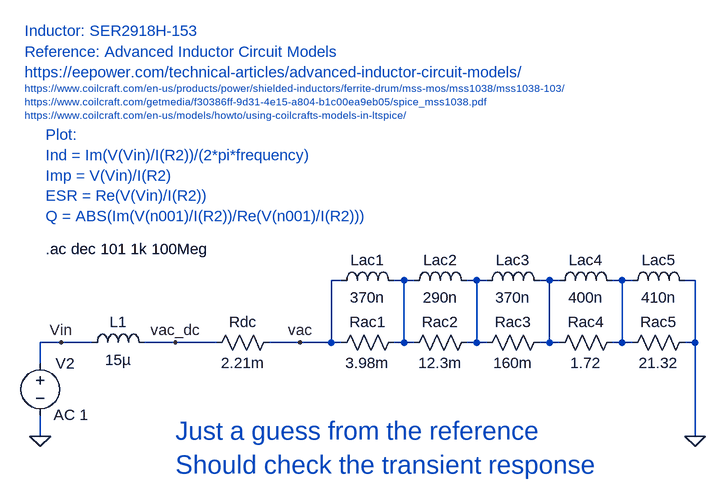
[diagram p0: schematic 10-SER2918H-153_non-linear_model_ridley_Rac.asc]
10-SER2918H-153_non-linear_model_ridley_Rac.asc, the LTspice schematic file:
Version 4
SHEET 1 1668 1520
WIRE 96 112 80 112
WIRE 192 112 176 112
WIRE 208 112 192 112
WIRE 304 112 288 112
WIRE 320 112 304 112
WIRE 416 112 400 112
WIRE 432 112 416 112
WIRE 528 112 512 112
WIRE 544 112 528 112
WIRE 640 112 624 112
WIRE -336 208 -368 208
WIRE -288 208 -336 208
WIRE -160 208 -208 208
WIRE -96 208 -160 208
WIRE 32 208 -16 208
WIRE 80 208 80 112
WIRE 80 208 32 208
WIRE 96 208 80 208
WIRE 192 208 192 112
WIRE 192 208 176 208
WIRE 208 208 192 208
WIRE 304 208 304 112
WIRE 304 208 288 208
WIRE 320 208 304 208
WIRE 416 208 416 112
WIRE 416 208 400 208
WIRE 432 208 416 208
WIRE 528 208 528 112
WIRE 528 208 512 208
WIRE 544 208 528 208
WIRE 640 208 640 112
WIRE 640 208 624 208
WIRE -368 240 -368 208
WIRE -368 352 -368 320
WIRE 640 352 640 208
FLAG -368 352 0
FLAG 640 352 0
FLAG -336 208 Vin
FLAG -160 208 vac_dc
FLAG 32 208 vac
SYMBOL voltage -368 224 R0
WINDOW 123 21 95 Left 2
WINDOW 39 0 0 Left 0
SYMATTR Value2 AC 1
SYMATTR InstName V2
SYMATTR Value ""
SYMBOL res 0 192 R90
WINDOW 0 0 56 VBottom 2
WINDOW 3 32 56 VTop 2
SYMATTR InstName Rdc
SYMATTR Value 2.21m
SYMBOL res 192 192 R90
WINDOW 0 0 56 VBottom 2
WINDOW 3 32 56 VTop 2
SYMATTR InstName Rac1
SYMATTR Value 3.98m
SYMBOL res 304 192 R90
WINDOW 0 0 56 VBottom 2
WINDOW 3 32 56 VTop 2
SYMATTR InstName Rac2
SYMATTR Value 12.3m
SYMBOL res 416 192 R90
WINDOW 0 0 56 VBottom 2
WINDOW 3 32 56 VTop 2
SYMATTR InstName Rac3
SYMATTR Value 160m
SYMBOL res 528 192 R90
WINDOW 0 0 56 VBottom 2
WINDOW 3 32 56 VTop 2
SYMATTR InstName Rac4
SYMATTR Value 1.72
SYMBOL res 640 192 R90
WINDOW 0 0 56 VBottom 2
WINDOW 3 32 56 VTop 2
SYMATTR InstName Rac5
SYMATTR Value 21.32
SYMBOL ind 80 128 R270
WINDOW 0 32 56 VTop 2
WINDOW 3 5 56 VBottom 2
SYMATTR InstName Lac1
SYMATTR Value 370n
SYMBOL ind 192 128 R270
WINDOW 0 32 56 VTop 2
WINDOW 3 5 56 VBottom 2
SYMATTR InstName Lac2
SYMATTR Value 290n
SYMBOL ind 304 128 R270
WINDOW 0 32 56 VTop 2
WINDOW 3 5 56 VBottom 2
SYMATTR InstName Lac3
SYMATTR Value 370n
SYMBOL ind 416 128 R270
WINDOW 0 32 56 VTop 2
WINDOW 3 5 56 VBottom 2
SYMATTR InstName Lac4
SYMATTR Value 400n
SYMBOL ind 528 128 R270
WINDOW 0 32 56 VTop 2
WINDOW 3 5 56 VBottom 2
SYMATTR InstName Lac5
SYMATTR Value 410n
SYMBOL ind -304 224 R270
WINDOW 0 32 56 VTop 2
WINDOW 3 5 56 VBottom 2
SYMATTR InstName L1
SYMATTR Value 15µ
TEXT -360 64 Left 2 !.ac dec 101 1k 100Meg
TEXT -392 -272 Left 2 ;Inductor: SER2918H-153
TEXT -392 -184 Left 1 ;https://www.coilcraft.com/en-us/products/power/shielded-inductors/ferrite-drum/mss-mos/mss1038/mss1038-103/\nhttps://www.coilcraft.com/getmedia/f30386ff-9d31-4e15-a804-b1c00ea9eb05/spice_mss1038.pdf\nhttps://www.coilcraft.com/en-us/models/howto/using-coilcrafts-models-in-ltspice/
TEXT -360 -112 Left 2 ;Plot:\nInd = Im(V(Vin)/I(R2))/(2*pi*frequency)\nImp = V(Vin)/I(R2)\nESR = Re(V(Vin)/I(R2))\nQ = ABS(Im(V(n001)/I(R2))/Re(V(n001)/I(R2)))
TEXT -392 -240 Left 2 ;Reference: Advanced Inductor Circuit Models\nhttps://eepower.com/technical-articles/advanced-inductor-circuit-models/
TEXT -160 344 Left 4 ;Just a guess from the reference\nShould check the transient response

The netlist it stands for:
* 10-SER2918H-153_non-linear_model_ridley_Rac.asc
V2 Vin 0 AC 1
Rdc vac vac_dc 2.21m
Rac1 N001 vac 3.98m
Rac2 N002 N001 12.3m
Rac3 N003 N002 160m
Rac4 N004 N003 1.72
Rac5 0 N004 21.32
Lac1 vac N001 370n
Lac2 N001 N002 290n
Lac3 N002 N003 370n
Lac4 N003 N004 400n
Lac5 N004 0 410n
L1 Vin vac_dc 15µ
.ac dec 101 1k 100Meg
* Inductor: SER2918H-153
* https://www.coilcraft.com/en-us/products/power/shielded-inductors/ferrite-drum/mss-mos/mss1038/mss1038-103/
* https://www.coilcraft.com/getmedia/f30386ff-9d31-4e15-a804-b1c00ea9eb05/spice_mss1038.pdf
* https://www.coilcraft.com/en-us/models/howto/using-coilcrafts-models-in-ltspice/
* Plot:
* Ind = Im(V(Vin)/I(R2))/(2*pi*frequency)
* Imp = V(Vin)/I(R2)
* ESR = Re(V(Vin)/I(R2))
* Q = ABS(Im(V(n001)/I(R2))/Re(V(n001)/I(R2)))
* Reference: Advanced Inductor Circuit Models
* https://eepower.com/technical-articles/advanced-inductor-circuit-models/
* Just a guess from the reference
* Should check the transient response
.backanno
.end

* Results of the author's LTspice run, read from the files saved beside the schematic
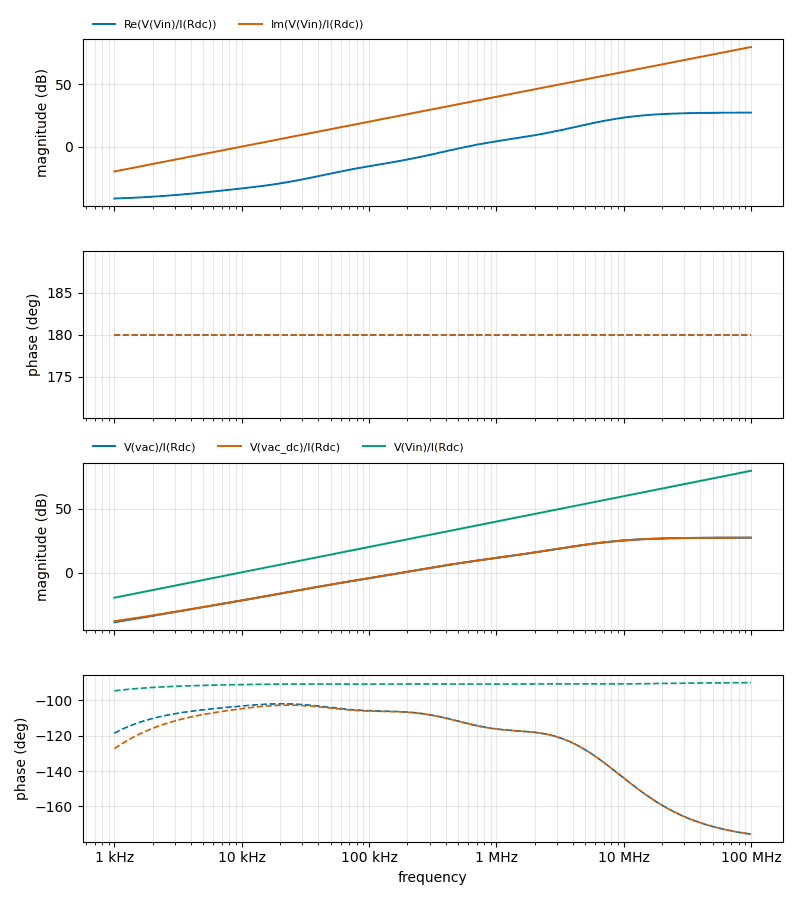
[diagram p1: AC Analysis of 10-SER2918H-153_non-linear_model_ridley_Rac.asc, plotted from the saved traces]
* AC Analysis, 1 run:
*   Re(V(Vin)/I(Rdc)): -41.17 dB at 1 kHz, 27.26 dB at 100 MHz, peak 27.26 dB at 100 MHz, 3 dB below the peak at 11.97 MHz
*   Im(V(Vin)/I(Rdc)): -19.63 dB at 1 kHz, 79.49 dB at 100 MHz, peak 79.49 dB at 100 MHz, 3 dB below the peak at 70.7 MHz
*   V(vac)/I(Rdc): -38.75 dB at 1 kHz, 27.29 dB at 100 MHz, peak 27.29 dB at 100 MHz, 3 dB below the peak at 8.08 MHz
*   V(vac_dc)/I(Rdc): -37.89 dB at 1 kHz, 27.29 dB at 100 MHz, peak 27.29 dB at 100 MHz, 3 dB below the peak at 8.08 MHz
*   V(Vin)/I(Rdc): -19.60 dB at 1 kHz, 79.49 dB at 100 MHz, peak 79.49 dB at 100 MHz, 3 dB below the peak at 70.7 MHz